# Altium schematic sheet plataR.SchDoc
size 420 x 297 mm; Scale: 1:1; DocumentType: Схема электрическая принципиальная; FirstReferrence: АБВГ.123456.001
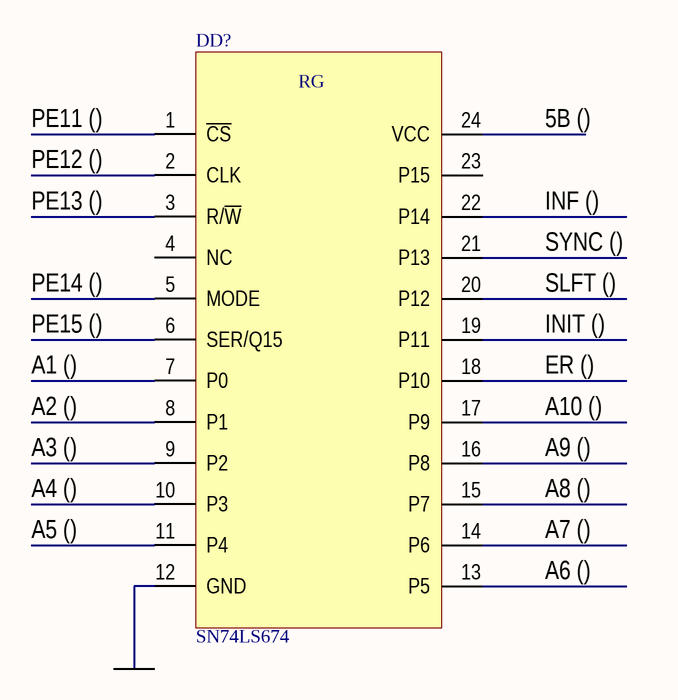
[diagram p0: plataR.SchDoc]

## Parts
DD?  SN74LS674  [SOP127P1030X265-24N]

## Nets

Not connected (* = marked no-connect by the designer): DD? 1(~{CS}) 2(CLK) 3(R/~{W}) 4(NC) 5(MODE) 6(SER/Q15) 7(P0) 8(P1) 9(P2) 10(P3) 11(P4) 12(GND) 13(P5) 14(P6) 15(P7) 16(P8) 17(P9) 18(P10) 19(P11) 20(P12) 21(P13) 22(P14) 23(P15) 24(VCC)

## Notes on the sheet
- (near DD?) PE11 ()
- (near DD?) PE12 ()
- (near DD?) PE13 ()
- 5В ()
- INF ()
- (near DD?) PE14 ()
- SYNC ()
- SLFT ()
- (near DD?) PE15 ()
- A1 ()
- A2 ()
- A10 ()
- INIT ()
- ER ()
- A3 ()
- A4 ()
- A9 ()
- A8 ()
- A5 ()
- A7 ()
- A6 ()
- Подп. и дата
- Инв. № дубл.
- Взам. инв. №
- Инв. № подл.
- Изм.
- Лист
- № докум.
- Подп.
- Дата
- 2.106-A3
- Копировал
- Формат А3
- (in symbol SN74LS674) RG